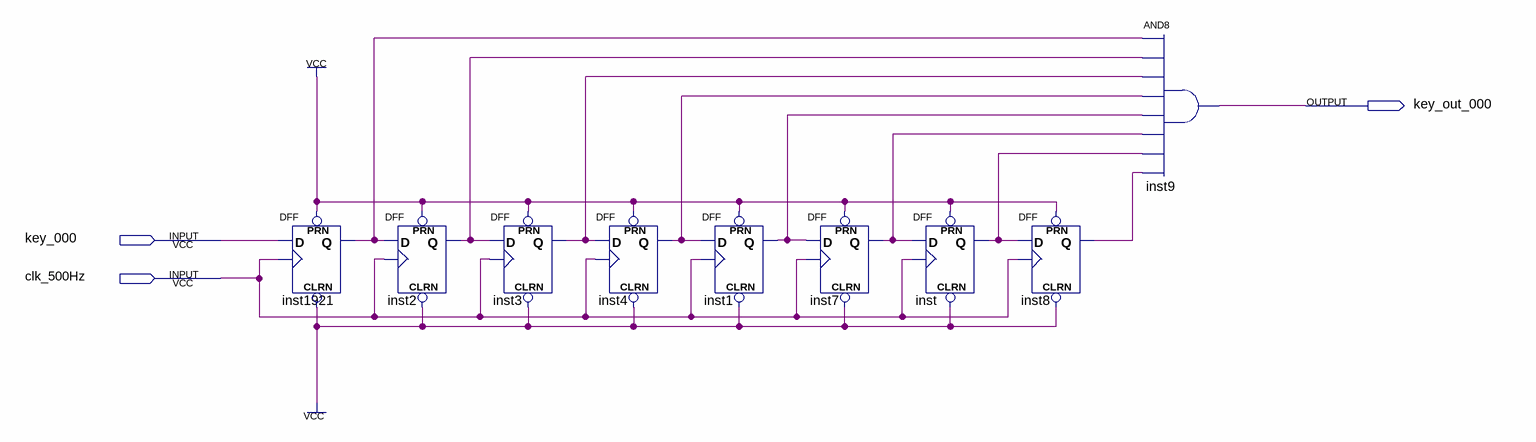
[diagram p0: schematic sheet]
// Quartus schematic key_debounce.bdf as structural Verilog: 9 symbols, 3 pins
module key_debounce (
  input  key_000,
  input  clk_500Hz,
  output key_out_000
);

  wire inst1_q, inst2_q, inst3_q, inst4_q, inst7_q, inst8_q, inst1921_q, inst_q;

  DFF inst1921 (.CLRN(1'b1), .CLK(clk_500Hz), .D(key_000), .PRN(1'b1), .Q(inst1921_q));
  DFF inst2 (.CLRN(1'b1), .CLK(clk_500Hz), .D(inst1921_q), .PRN(1'b1), .Q(inst2_q));
  DFF inst3 (.CLRN(1'b1), .CLK(clk_500Hz), .D(inst2_q), .PRN(1'b1), .Q(inst3_q));
  DFF inst4 (.CLRN(1'b1), .CLK(clk_500Hz), .D(inst3_q), .PRN(1'b1), .Q(inst4_q));
  DFF inst1 (.CLRN(1'b1), .CLK(clk_500Hz), .D(inst4_q), .PRN(1'b1), .Q(inst1_q));
  DFF inst7 (.CLRN(1'b1), .CLK(clk_500Hz), .D(inst1_q), .PRN(1'b1), .Q(inst7_q));
  DFF inst (.CLRN(1'b1), .CLK(clk_500Hz), .D(inst7_q), .PRN(1'b1), .Q(inst_q));
  DFF inst8 (.CLRN(1'b1), .CLK(clk_500Hz), .D(inst_q), .PRN(1'b1), .Q(inst8_q));
  and inst9 (key_out_000, inst1921_q, inst2_q, inst3_q, inst4_q, inst1_q, inst7_q, inst_q, inst8_q);
endmodule
